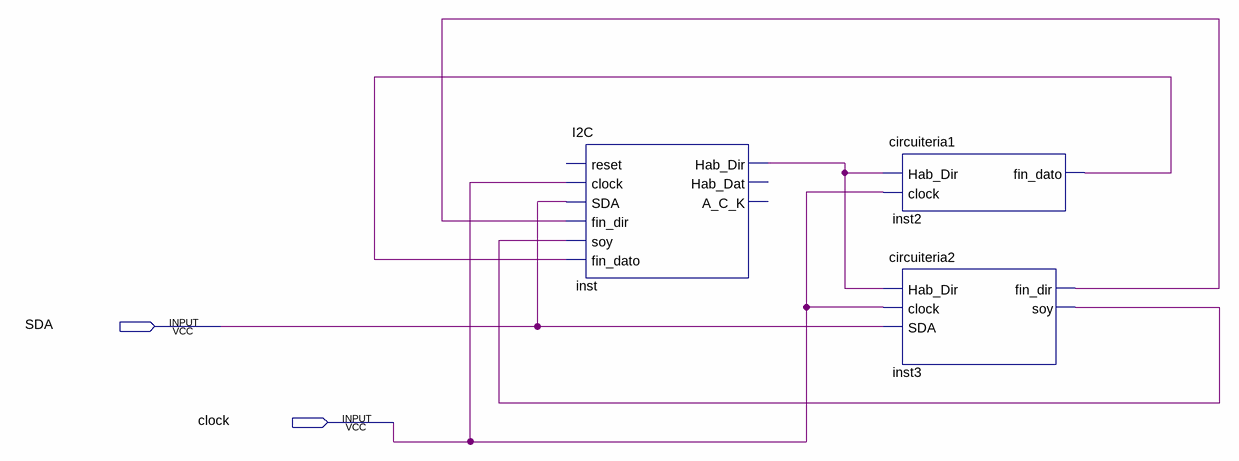
[diagram p0: schematic sheet]
// Quartus schematic esquematicoI2C.bdf as structural Verilog: 3 symbols, 2 pins
module esquematicoI2C (
  input  SDA,
  input  clock
);

  wire inst2_fin_dato, inst3_fin_dir, inst3_soy, inst_hab_dir;

  I2C inst (
    .clock(clock), .SDA(SDA), .fin_dir(inst3_fin_dir), .soy(inst3_soy), .fin_dato(inst2_fin_dato),
    .Hab_Dir(inst_hab_dir));  // open: reset, Hab_Dat, A_C_K
  circuiteria1 inst2 (.Hab_Dir(inst_hab_dir), .clock(clock), .fin_dato(inst2_fin_dato));
  circuiteria2 inst3 (.Hab_Dir(inst_hab_dir), .clock(clock), .SDA(SDA), .fin_dir(inst3_fin_dir), .soy(inst3_soy));
endmodule
